# Altium project Com_Board_2018.PrjPcb
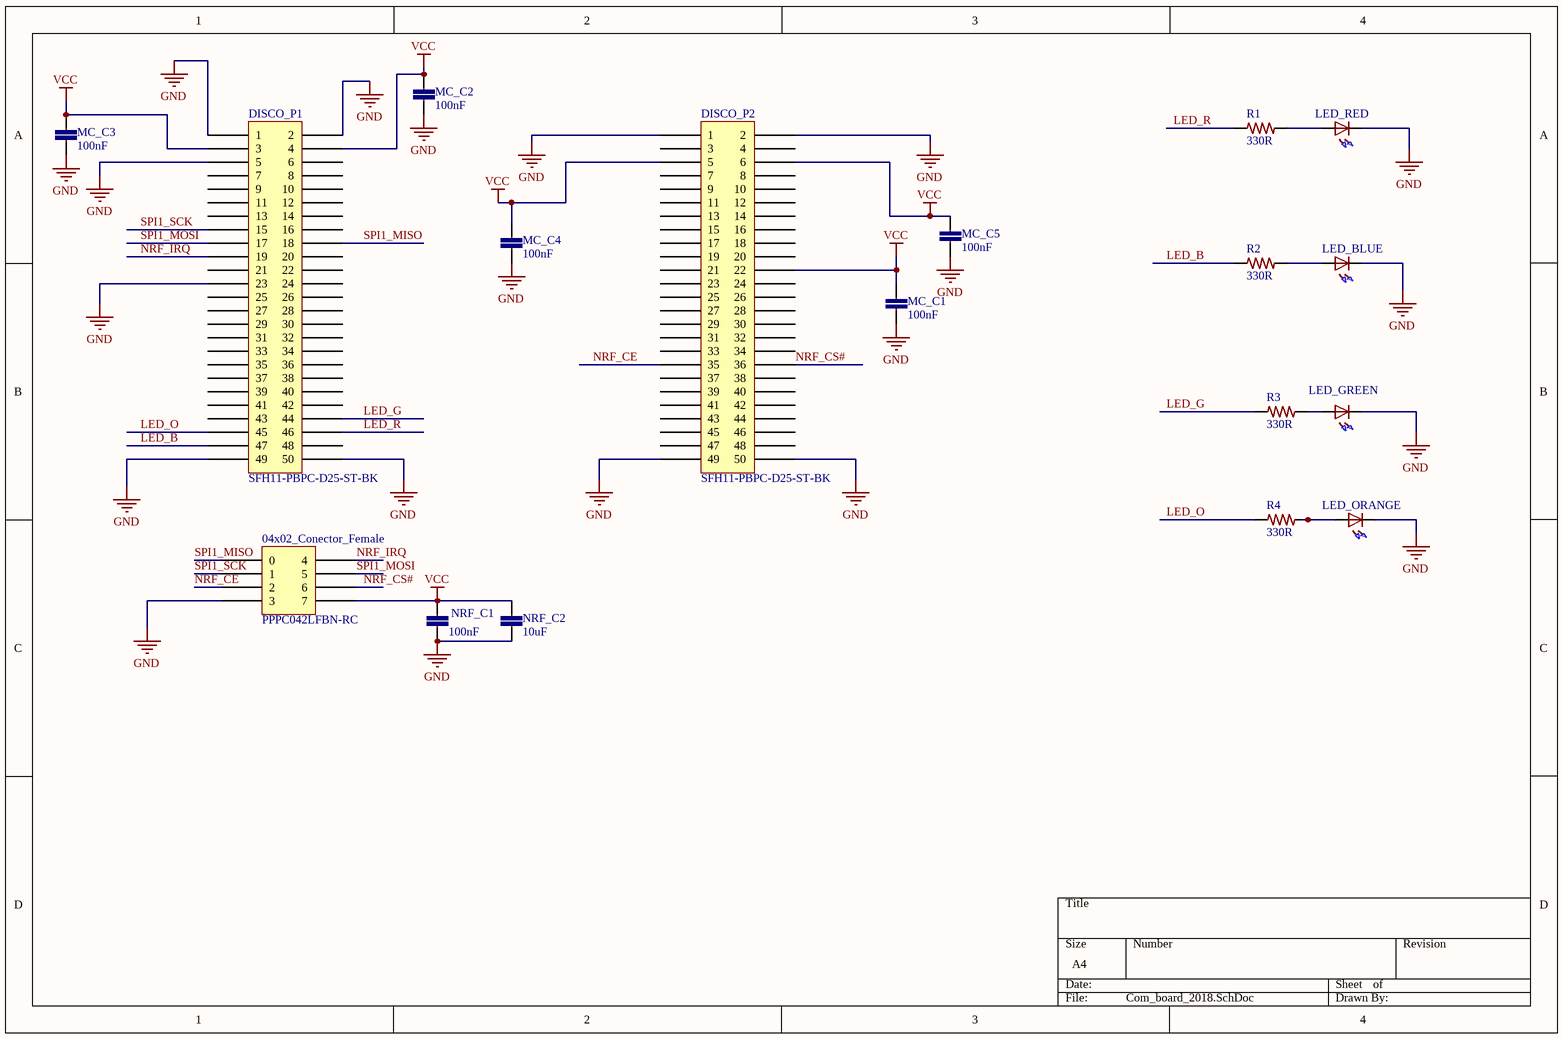
[diagram p0: Com_board_2018.SchDoc]
2 sheets, 56 parts. Net scope: hierarchical (ports join the sheet entries above them; power ports are global).
Board file: Com_Board_2018.PcbDoc
Sheets:
  Com_board_2018.SchDoc
  Periféricos.SchDoc

## Sheet Com_board_2018.SchDoc
size A4

### Parts
(Parts that share a designator on the sheet are numbered #1, #2 ... from top to bottom, then left to right.)
04x02_Conector_Female  PPPC042LFBN-RC  [04x02_Conector_Female]
DISCO_P1  SFH11-PBPC-D25-ST-BK  [25x02_Conector_Female]
DISCO_P2  SFH11-PBPC-D25-ST-BK  [25x02_Conector_Female]
LED_BLUE  LED  [LED-5MM-PCB]  (value not drawn)
LED_GREEN  LED  [LED-5MM-PCB]  (value not drawn)
LED_ORANGE  LED  [LED-5MM-PCB]  (value not drawn)
LED_RED  LED  [LED-5MM-PCB]  (value not drawn)
MC_C1  100nF  [0402-CAP]
MC_C2  100nF  [0402-CAP]
MC_C3  100nF  [0402-CAP]
MC_C4  100nF  [0402-CAP]
MC_C5  100nF  [0402-CAP]
NRF_C1#1  100nF  [0402-CAP]
NRF_C2  10uF  [0805-CAP]
R1  330R  [0402-RES-HD]
R2  330R  [0402-RES-HD]
R3  330R  [0402-RES-HD]
R4  330R  [0402-RES-HD]

### Nets
GND: 04x02_Conector_Female.3 DISCO_P1.1 DISCO_P1.2 DISCO_P1.5 DISCO_P1.23 DISCO_P1.49 DISCO_P1.50 DISCO_P2.1 DISCO_P2.2 DISCO_P2.49 DISCO_P2.50 LED_BLUE.1(K) LED_GREEN.1(K) LED_ORANGE.1(K) LED_RED.1(K) MC_C1.1 MC_C2.1 MC_C3.2 MC_C4.1 MC_C5.1 NRF_C1#1.2 NRF_C2.2
VCC: 04x02_Conector_Female.7 DISCO_P1.3 DISCO_P1.4 DISCO_P2.5 DISCO_P2.6 DISCO_P2.22 MC_C1.2 MC_C2.2 MC_C3.1 MC_C4.2 MC_C5.2 NRF_C1#1.1 NRF_C2.1
LED_B: DISCO_P1.47 R2.1
LED_G: DISCO_P1.44 R3.1
LED_O: DISCO_P1.45 R4.1
LED_R: DISCO_P1.46 R1.1
NRF_CE: 04x02_Conector_Female.2 DISCO_P2.35
NRF_CS#: 04x02_Conector_Female.6 DISCO_P2.36
NRF_IRQ: 04x02_Conector_Female.4 DISCO_P1.19
SPI1_MISO: 04x02_Conector_Female.0 DISCO_P1.18
SPI1_MOSI: 04x02_Conector_Female.5 DISCO_P1.17
SPI1_SCK: 04x02_Conector_Female.1 DISCO_P1.15
NetLED_BLUE_2: LED_BLUE.2(A) R2.2
NetLED_GREEN_2: LED_GREEN.2(A) R3.2
NetLED_ORANGE_2: LED_ORANGE.2(A) R4.2
NetLED_RED_2: LED_RED.2(A) R1.2

Not connected (* = marked no-connect by the designer): DISCO_P1 6 7 8 9 10 11 12 13 14 16 20 21 22 24 25 26 27 28 29 30 31 32 33 34 35 36 37 38 39 40 41 42 43 48; DISCO_P2 3 4 7 8 9 10 11 12 13 14 15 16 17 18 19 20 21 23 24 25 26 27 28 29 30 31 32 33 34 37 38 39 40 41 42 43 44 45 46 47 48

### Library data of the parts
04x02_Conector_Female = 04x02_Conector_Female: 8 Position Header Connector 0.100" (2.54mm) Through Hole Gold
DISCO_P1 DISCO_P2 = 25x02_Conector_Female: 50 Position Header Connector 0.100" (2.54mm) Through Hole Gold
LED_BLUE LED_GREEN LED_ORANGE LED_RED = LED-5MM-3: LED 5MM PTH
MC_C1-MC_C5 NRF_C1#1 = CC0402-100nF-A.12: CAP CER 0.1UF 10V 20% X5R 0402; Part No: VJ0402V104ZXQPBC; Cod EMS: 05.281.006.133; Value: 100n
NRF_C2 = CC0806-10uF-25V-1: CAP CER 10UF 25V X5R 0805; Part No: GRM21BR61E106KA73L; Cod EMS: 05.281.019.590; Value: 10uF
R1-R4 = R0402-330R-7: RES 330 OHM 1/10W 1% 0402 SMD; Part No: ERJ-2RKF3300X; Cod EMS: 05.280.029.506; Value: 330; Family Description: RESISTOR FILME ESPESSO 10R-1M / 1/10W / 1% / 0402. P/N: ERJ-2RKF....X – PANASONIC ELECTRONIC COMPONENTS.; Family: ERJ-2RKF....X

## Sheet Periféricos.SchDoc
size A4
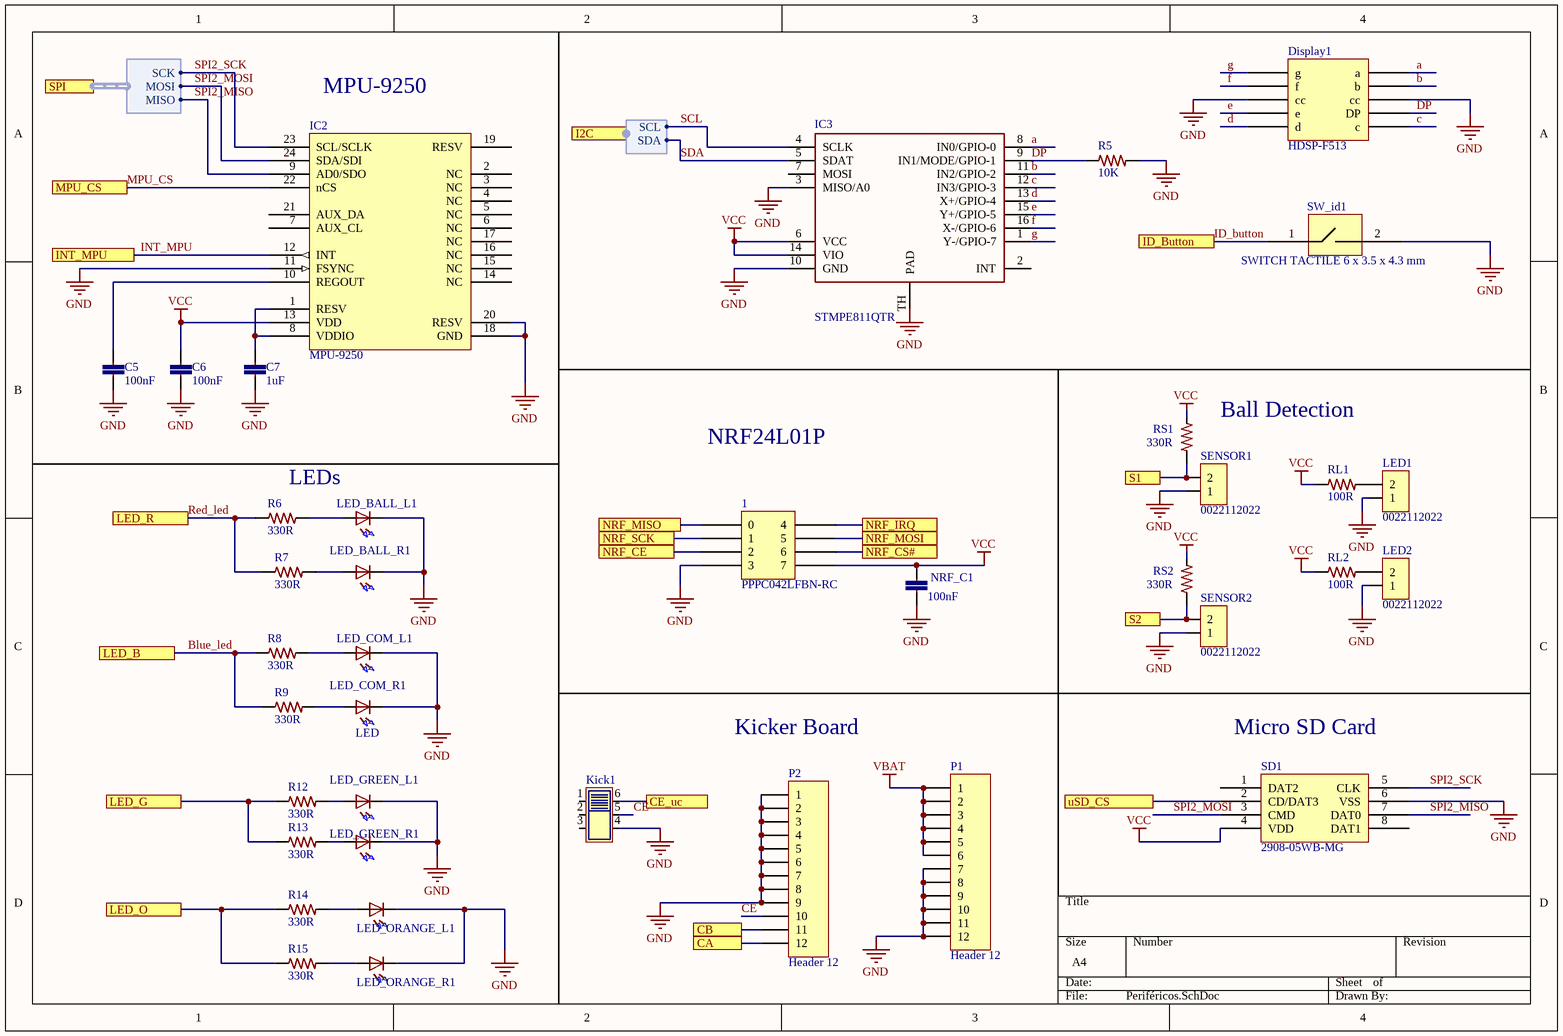
[diagram p1: Periféricos.SchDoc]

### Parts
(Parts that share a designator on the sheet are numbered #1, #2 ... from top to bottom, then left to right.)
1  PPPC042LFBN-RC  [04x02_Conector_Female]
C5  100nF  [0402-CAP]
C6  100nF  [0402-CAP]
C7  1uF  [0402-CAP]
Display1  HDSP-F513  [New footprint 1]
IC2  MPU-9250  [MPU-9250]
IC3  STMPE811QTR  [QFN16_N]
Kick1  JS202011SCQN  [SOP250P750X350-6N]  (value not drawn)
LED1  0022112022  [02x01_Conector_Male]
LED2  0022112022  [02x01_Conector_Male]
LED_BALL_L1  LED  [LED-5MM-PCB]  (value not drawn)
LED_BALL_R1  LED  [LED-5MM-PCB]  (value not drawn)
LED_COM_L1  LED  [LED-5MM-PCB]  (value not drawn)
LED_COM_R1  LED  [LED-5MM-PCB]
LED_GREEN_L1  LED  [LED-5MM-PCB]  (value not drawn)
LED_GREEN_R1  LED  [LED-5MM-PCB]  (value not drawn)
LED_ORANGE_L1  LED  [LED-5MM-PCB]  (value not drawn)
LED_ORANGE_R1  LED  [LED-5MM-PCB]  (value not drawn)
NRF_C1#2  100nF  [0402-CAP]
P1  Header 12  [HDR1X12]
P2  Header 12  [HDR1X12]
R5  10K  [0402-RES-HD]
R6  330R  [0402-RES-HD]
R7  330R  [0402-RES-HD]
R8  330R  [0402-RES-HD]
R9  330R  [0402-RES-HD]
R12  330R  [0402-RES-HD]
R13  330R  [0402-RES-HD]
R14  330R  [0402-RES-HD]
R15  330R  [0402-RES-HD]
RL1  100R  [0402-RES-HD]
RL2  100R  [0402-RES-HD]
RS1  330R  [0402-RES-HD]
RS2  330R  [0402-RES-HD]
SD1  2908-05WB-MG  [New footprint 1]
SENSOR1  0022112022  [02x01_Conector_Male]
SENSOR2  0022112022  [02x01_Conector_Male]
SW_id1  SWITCH TACTILE 6 x 3.5 x 4.3 mm  [PCBComponent]

### Ports
CA, CB, CE_uc, I2C (harness I2C), ID_Button, INT_MPU, LED_B, LED_G, LED_O, LED_R, MPU_CS, NRF_CE, NRF_CS#, NRF_IRQ, NRF_MISO, NRF_MOSI, NRF_SCK, S1, S2, SPI (harness SPI), uSD_CS

### Harnesses
SPI: MOSI, MISO, SCK
I2C: SCL, SDA

### Nets
GND: 1.3 C5.2 C6.2 C7.2 Display1.3(cc) Display1.8(cc) IC2.11(FSYNC) IC2.18(GND) IC2.20(RESV) IC3.3(MISO/A0) IC3.10(GND) IC3.TH(PAD) Kick1.4 LED1.1 LED2.1 LED_BALL_L1.1(K) LED_BALL_R1.1(K) LED_COM_L1.1(K) LED_COM_R1.1(K) LED_GREEN_L1.1(K) LED_GREEN_R1.1(K) LED_ORANGE_L1.1(K) LED_ORANGE_R1.1(K) NRF_C1#2.2 P1.7 P1.8 P1.9 P1.10 P1.11 P1.12 P2.1 P2.2 P2.3 P2.4 P2.5 P2.6 P2.7 P2.8 P2.9 R5.2 SD1.6(VSS) SENSOR1.1 SENSOR2.1 SW_id1.2
VBAT: P1.1 P1.2 P1.3 P1.4 P1.5 P1.6
VCC: 1.7 C6.1 IC2.13(VDD) IC3.6(VCC) IC3.14(VIO) NRF_C1#2.1 RL1.1 RL2.1 RS1.2 RS2.2 SD1.4(VDD)
a: Display1.6(a) IC3.8(IN0/GPIO-0)
b: Display1.7(b) IC3.11(IN2/GPIO-2)
Blue_led: R8.1 R9.1 ; port LED_B
c: Display1.10(c) IC3.12(IN3/GPIO-3)
CE: Kick1.5 P2.10
d: Display1.5(d) IC3.13(X+/GPIO-4)
DP: Display1.9(DP) IC3.9(IN1/MODE/GPIO-1) R5.1
e: Display1.4(e) IC3.15(Y+/GPIO-5)
f: Display1.2(f) IC3.16(X-/GPIO-6)
g: Display1.1(g) IC3.1(Y-/GPIO-7)
ID_button: SW_id1.1 ; port ID_Button
INT_MPU: IC2.12(INT) ; port INT_MPU
MPU_CS: IC2.22(nCS) ; port MPU_CS
Red_led: R6.1 R7.1 ; port LED_R
SCL: IC3.4(SCLK) ; port I2C.SCL
SDA: IC3.5(SDAT) ; port I2C.SDA
SPI2_MISO: IC2.9(AD0/SDO) SD1.7(DAT0) ; port SPI.MISO
SPI2_MOSI: IC2.24(SDA/SDI) SD1.3(CMD) ; port SPI.MOSI
SPI2_SCK: IC2.23(SCL/SCLK) SD1.5(CLK) ; port SPI.SCK
Net1_0: 1.0 ; port NRF_MISO
Net1_1: 1.1 ; port NRF_SCK
Net1_2: 1.2 ; port NRF_CE
Net1_4: 1.4 ; port NRF_IRQ
Net1_5: 1.5 ; port NRF_MOSI
Net1_6: 1.6 ; port NRF_CS#
NetC5_1: C5.1 IC2.10(REGOUT)
NetC7_1: C7.1 IC2.1(RESV) IC2.8(VDDIO)
NetKick1_6: Kick1.6 ; port CE_uc
NetLED1_2: LED1.2 RL1.2
NetLED2_2: LED2.2 RL2.2
NetLED_BALL_L1_2: LED_BALL_L1.2(A) R6.2
NetLED_BALL_R1_2: LED_BALL_R1.2(A) R7.2
NetLED_COM_L1_2: LED_COM_L1.2(A) R8.2
NetLED_COM_R1_2: LED_COM_R1.2(A) R9.2
NetLED_GREEN_L1_2: LED_GREEN_L1.2(A) R12.2
NetLED_GREEN_R1_2: LED_GREEN_R1.2(A) R13.2
NetLED_ORANGE_L1_2: LED_ORANGE_L1.2(A) R14.2
NetLED_ORANGE_R1_2: LED_ORANGE_R1.2(A) R15.2
NetP2_11: P2.11 ; port CB
NetP2_12: P2.12 ; port CA
NetR12_1: R12.1 R13.1 ; port LED_G
NetR14_1: R14.1 R15.1 ; port LED_O
NetRS1_1: RS1.1 SENSOR1.2 ; port S1
NetRS2_1: RS2.1 SENSOR2.2 ; port S2
NetSD1_2: SD1.2(CD/DAT3) ; port uSD_CS

Not connected (* = marked no-connect by the designer): IC2 2(NC) 3(NC) 4(NC) 5(NC) 6(NC) 7(AUX_CL) 14(NC) 15(NC) 16(NC) 17(NC) 19(RESV) 21(AUX_DA); IC3 2(INT) 7(MOSI); Kick1 1 2 3; SD1 1(DAT2) 8(DAT1)

### Notes on the sheet
- (near IC2) MPU-9250
- NRF24L01P
- (near RS1) Ball Detection
- LEDs
- Kicker Board
- (near SD1) Micro SD Card

### Library data of the parts
1 = 04x02_Conector_Female: as 04x02_Conector_Female on sheet Com_board_2018
C5 C6 NRF_C1#2 = CC0402-100nF-A.12: as MC_C1 on sheet Com_board_2018
C7 = CC0402-1uF-5: CAP CER 1UF 6.3V 10% X5R 0402; Part No: JMK105BJ105KV-F; Cod EMS: 05.281.019.513; Value: 1u
Display1 = HDSP-F513-01.A.2: 7 segments display
IC2 = MPU-9250-1: IMU ACCEL/GYRO/MAG I2C/SPI 24QFN; Part No: MPU-9250
IC3 = STMPE811QTR-6: IC TSC I/O EXPAND 8B 16QFN; Cod EMS: 05.284.001.511; Part No: STMPE811QTR
Kick1 = JS202011SCQN-1: SWITCH SLIDE DPDT 300MA 6V; Part No: JS202011SCQN
LED1 LED2 SENSOR1 SENSOR2 = 02x01_Conector_Male: CONN HEADER 2POS .100 VERT GOLD
LED_BALL_L1 LED_BALL_R1 LED_COM_L1 LED_COM_R1 LED_GREEN_L1 LED_GREEN_R1 LED_ORANGE_L1 LED_ORANGE_R1 = LED-5MM-3: LED 5MM PTH
P1 P2 = Header 12: Header, 12-Pin; LatestRevisionDate: 17-Jul-2002; LatestRevisionNote: Re-released for DXP Platform.; Publisher: Altium Limited
R5 = R0402-10K-11: RES 10K OHM 1/10W 1% 0402 SMD; Part No: ERJ-2RKF1002X; Cod EMS: 05.280.029.525; Family Description: RESISTOR FILME ESPESSO 10R-1M / 1/10W / 1% / 0402. P/N: ERJ-2RKF....X – PANASONIC ELECTRONIC COMPONENTS.; Value: 10K; Family: ERJ-2RKF....X
R6-R9 R12-R15 = R0402-330R-7: as R1 on sheet Com_board_2018; Family: ERJ-2RKF....X
RL1 RL2 = R0402-100R-5: RES 100 OHM 1/10W 1% 0402 SMD; Part No: ERJ-2RKF1000X; Value: 100; Cod EMS: 05.280.029.519; Family Description: RESISTOR FILME ESPESSO 10R-1M / 1/10W / 1% / 0402. P/N: ERJ-2RKF....X – PANASONIC ELECTRONIC COMPONENTS.; Family: ERJ-2RKF....X
RS1 RS2 = R0402-330R-7: RES 330 OHM 1/10W 1% 0402 SMD; Part No: ERJ-2RKF3300X; Value: 330; Cod EMS: 05.280.029.506; Family Description: RESISTOR FILME ESPESSO 10R-1M / 1/10W / 1% / 0402. P/N: ERJ-2RKF....X – PANASONIC ELECTRONIC COMPONENTS.; Family: ERJ-2RKF....X
SD1 = 2908-05WB-MG-01.A.1: CONN MICRO SD CARD PUSH-PUSH R/A
SW_id1 = 95C04A3GWRT.-1: GRAYHILL TACT,GW,6X3.5,1800T&R,LF Eight, 160g Operating Force, Gull Wing, RoHS Compliant; Part No: 95C04A3GWRT

## Nets that join several sheets
GND: Com_board_2018 (22 pins), Periféricos (44 pins)
VCC: Com_board_2018 (13 pins), Periféricos (11 pins)